# EAGLE schematic crystal-test-breakout (EAGLE 6.5.0)
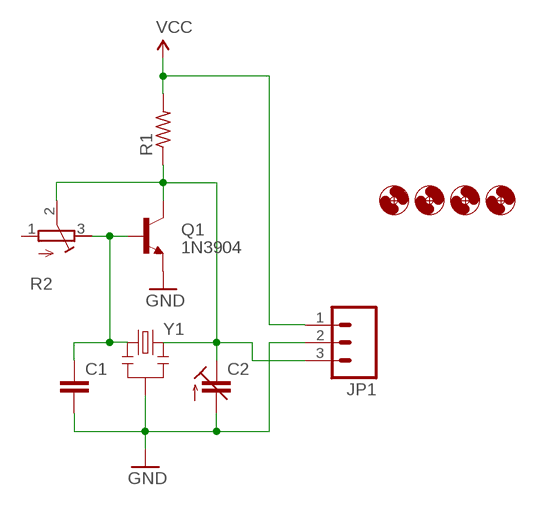
[diagram p0: schematic, sheet 1]

## Parts
C1  CAPACITOR-CERAMIC025-025X050  [C025-025X050]
C2  CAPACITOR-TRIM3050.504  [CTRIM3050.504]
H1  HOLE#2  [HOLE-#2]
H2  HOLE#2  [HOLE-#2]
H3  HOLE#2  [HOLE-#2]
H4  HOLE#2  [HOLE-#2]
JP1  M03PTH  [1X03]
Q1  1N3904  TRANSISTOR_NPNTO-92-AMMO-EBC  [TO-92-AMMO]
R1  RESISTORPTH-AXIAL-5.08MM  [RESISTOR-AXIAL-PTH-5.08MM]
R2  POTENTIOMETER3296W-SIDE  [RTRIM3296W-SIDEWAYS]
Y1  RESONATORPTH  [RESONATOR-PTH]

## Nets
GND: C1.2 C2.2(A) JP1.2 Q1.1(E) Y1.2
N$1: C1.1 Q1.2(B) R2.3(E) Y1.1
N$4: C2.1(E) JP1.3 Q1.3(C) R1.P$1 R2.2(S) Y1.3
VCC: JP1.1 R1.P$2
Unconnected: R2.1(A)

## Library data of the parts
C1 = A_butts:CAPACITOR-CERAMIC: CAPACITOR, European symbol
C2 = A_butts:CAPACITOR-TRIM: Trimm capacitor
H1-H4 = A_butts:HOLE: MOUNTING HOLE with drill center marker
JP1 = A_butts:M03: Header 3 Standard 3-pin 0.1" header. Use with straight break away headers (SKU : PRT-00116), right angle break away headers (PRT-00553), swiss pins (PRT-00743), machine pins (PRT-00117), and female headers (PRT-00115). Molex polarized connector foot print use with SKU : PRT-08232 with associated crimp pins and housings.
Q1 = A_butts:TRANSISTOR_NPN: Generic NPN BJT MMBT2222A - TRANS-08049 (SOT-23, 1A 40V) MPSA42 - TRANS-09116 (SOT-23, 500mA 300V) MMBT5088LT1G - TRANS-11160 (SOT-23, 50 mA 30V) BC547 - COM-08928 <http://www.sparkfun.com/products/8928> (TO-92 45V 100mA) (1.Collector 2.Base 3.Emitter) 2N3904 - COM-00521 <http://www.sparkfun.com/products/521> (TO-92 40V 200mA) (1.Emitter 2.Base 3.Collector) P2N2222A - COM-12852 <http://www.sparkfun.com/products/12852> (TO-92 40V 600mA) (1.Collector 2.Base 3.Emitter)
R1 = A_butts:RESISTOR: RESISTOR, American symbol
R2 = A_butts:POTENTIOMETER: Trimm resistor
Y1 = A_butts:RESONATOR: Resonator Small SMD resonator. Used, eg, on the Arduino Pro/ Pro Mini boards. 8MHz- XTAL-08895 16MHz- XTAL-08900